# EAGLE design Moof Janibore (EAGLE 9.6.2)
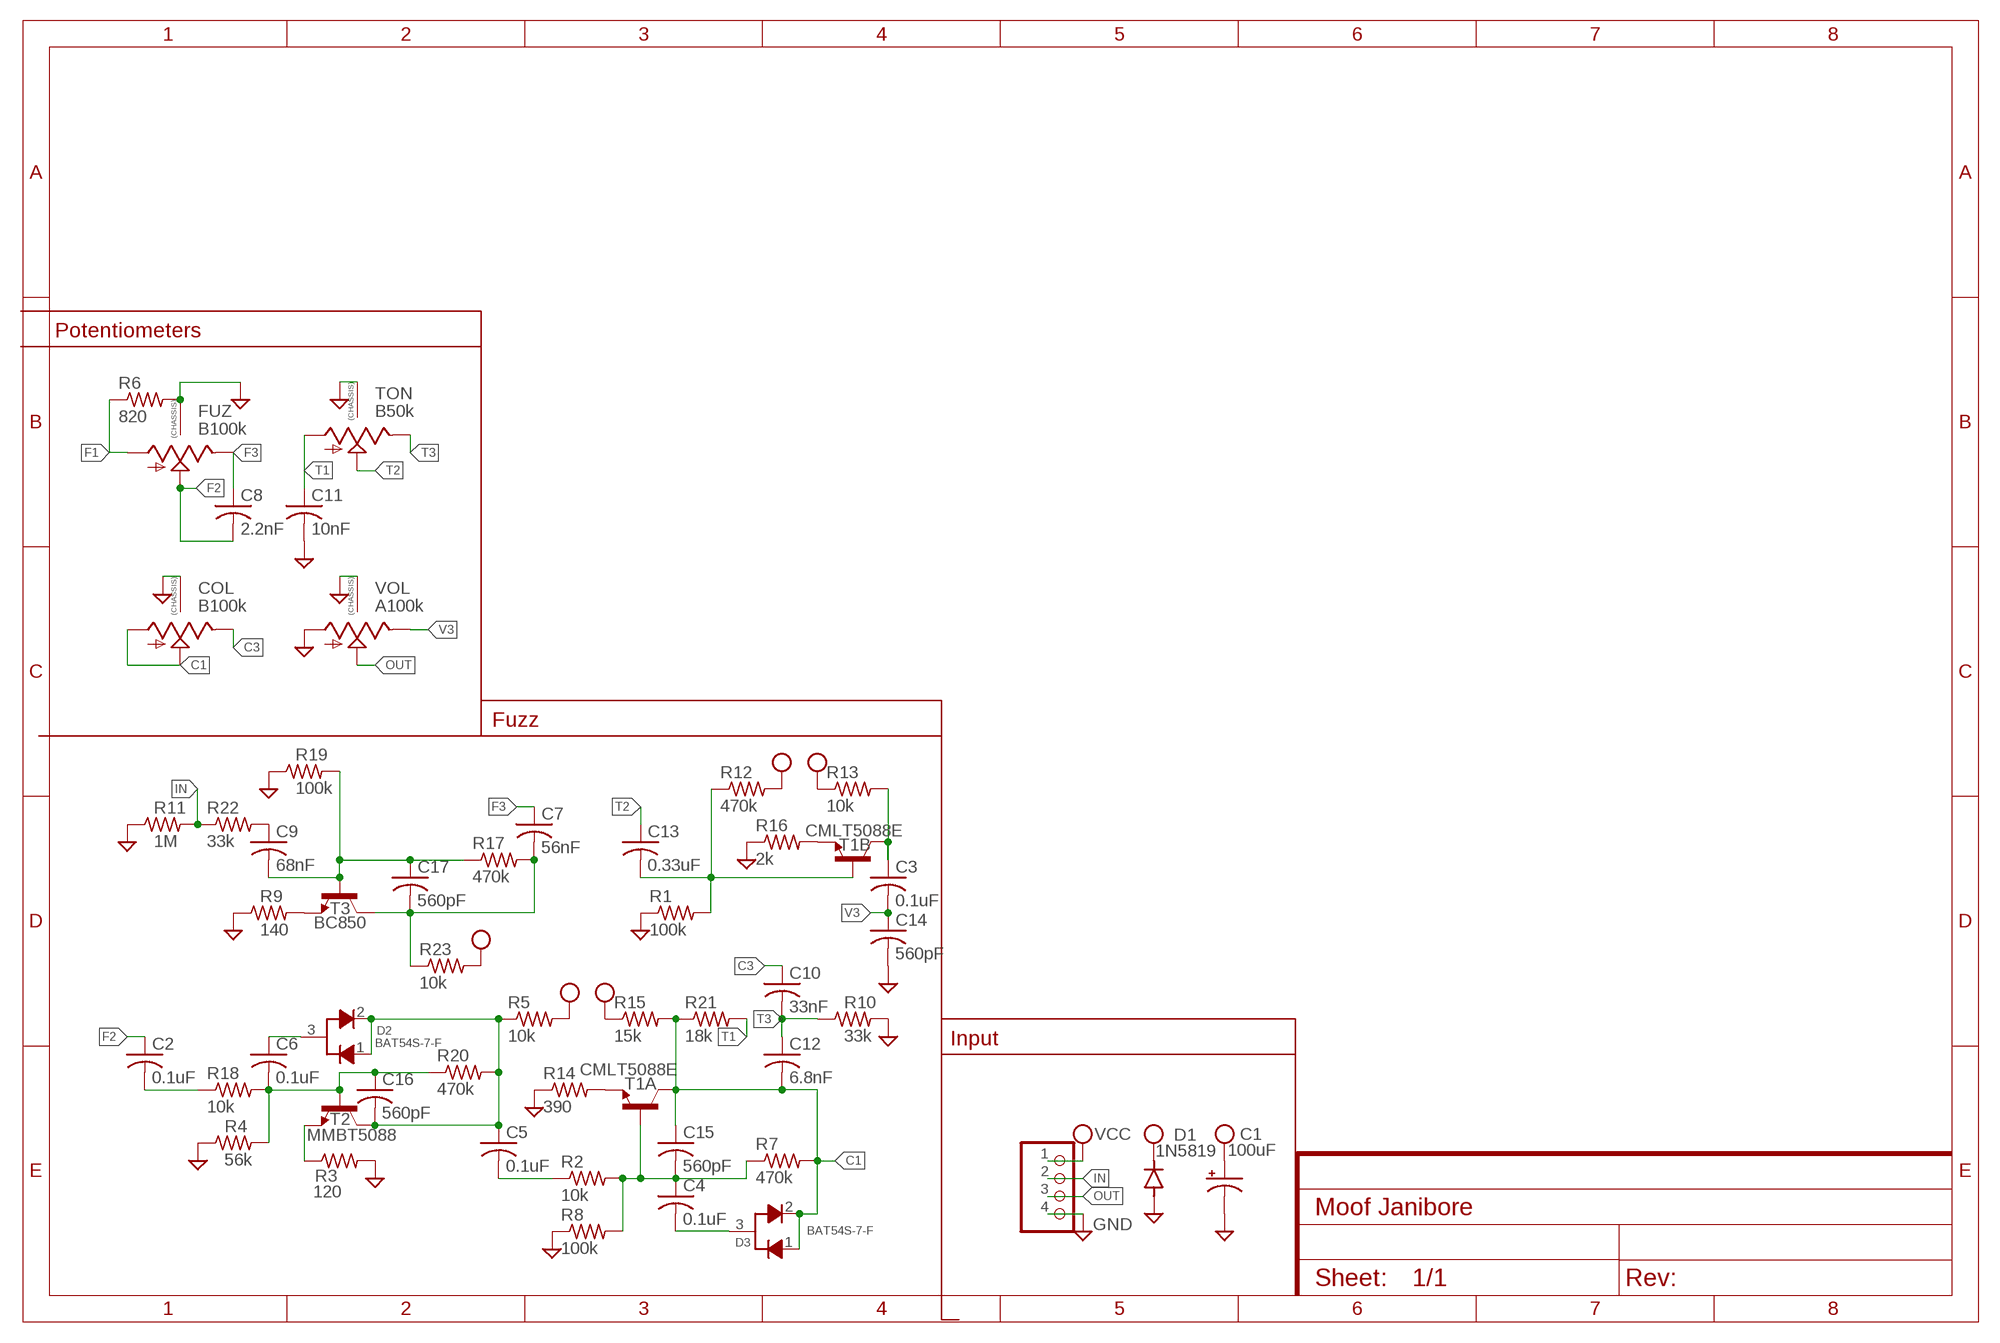
[diagram p0: schematic, sheet 1]

## Parts
C1  100uF  CAP_SMD+THRUPAN_B  [PAN_B_SMD+THRU]
C2  0.1uF  C-USC0402  [C0402]
C3  0.1uF  C-USC0402  [C0402]
C4  0.1uF  C-USC0402  [C0402]
C5  0.1uF  C-USC0402  [C0402]
C6  0.1uF  C-USC0402  [C0402]
C7  56nF  C-USC0402  [C0402]
C8  2.2nF  C-USC0402  [C0402]
C9  68nF  C-USC0402  [C0402]
C10  33nF  C-USC0402  [C0402]
C11  10nF  C-USC0402  [C0402]
C12  6.8nF  C-USC0402  [C0402]
C13  0.33uF  C-USC0402  [C0402]
C14  560pF  C-USC0402  [C0402]
C15  560pF  C-USC0402  [C0402]
C16  560pF  C-USC0402  [C0402]
C17  560pF  C-USC0402  [C0402]
COL  B100k  9MM_SNAP-IN_POT_CHASSIS  [9MM_SNAP-IN_POT]
D1  1N5819  DIODE-SOD123  [SOD123]
D2  BAT54S-7-F  [SOT23-3]
D3  BAT54S-7-F  [SOT23-3]
FUZ  B100k  9MM_SNAP-IN_POT_CHASSIS  [9MM_SNAP-IN_POT]
JP1  PINHD-1X4  [1X04]
R1  100k  R-US_R0402  [R0402]
R2  10k  R-US_R0402  [R0402]
R3  120  R-US_R0402  [R0402]
R4  56k  R-US_R0402  [R0402]
R5  10k  R-US_R0402  [R0402]
R6  820  R-US_R0402  [R0402]
R7  470k  R-US_R0402  [R0402]
R8  100k  R-US_R0402  [R0402]
R9  140  R-US_R0402  [R0402]
R10  33k  R-US_R0402  [R0402]
R11  1M  R-US_R0402  [R0402]
R12  470k  R-US_R0402  [R0402]
R13  10k  R-US_R0402  [R0402]
R14  390  R-US_R0402  [R0402]
R15  15k  R-US_R0402  [R0402]
R16  2k  R-US_R0402  [R0402]
R17  470k  R-US_R0402  [R0402]
R18  10k  R-US_R0402  [R0402]
R19  100k  R-US_R0402  [R0402]
R20  470k  R-US_R0402  [R0402]
R21  18k  R-US_R0402  [R0402]
R22  33k  R-US_R0402  [R0402]
R23  10k  R-US_R0402  [R0402]
T1  CMLT5088E  [SOT563]
T2  MMBT5088  BC850-NPN-SOT23-BEC  [SOT23-BEC]
T3  BC850  BC850-NPN-SOT23-BEC  [SOT23-BEC]
TON  B50k  9MM_SNAP-IN_POT_CHASSIS  [9MM_SNAP-IN_POT]
VOL  A100k  9MM_SNAP-IN_POT_CHASSIS  [9MM_SNAP-IN_POT]

## Nets
C1: C12.2 C15.1 COL.1(A) COL.2(S) D3.1 D3.2 R7.2 R15.2 R21.1 T1.6(A:C)
C3: C10.1 COL.3(E)
F1: FUZ.1(A) R6.1
F2: C2.1 C8.2 FUZ.2(S)
F3: C7.1 C8.1 FUZ.3(E)
GND: C1.- C1.--(-) C11.2 C14.2 COL.CHASSIS1 COL.CHASSIS2 D1.A FUZ.CHASSIS1 FUZ.CHASSIS2 JP1.4 R1.1 R3.2 R4.1 R6.2 R8.1 R9.1 R10.2 R11.1 R14.1 R16.1 R19.1 TON.CHASSIS1 TON.CHASSIS2 VOL.1(A) VOL.CHASSIS1 VOL.CHASSIS2
IN: JP1.2 R11.2 R22.1
N$1: C9.1 R22.2
N$2: C7.2 C17.2 R17.2 R23.1 T3.C
N$3: C9.2 C17.1 R17.1 R19.2 T3.B
N$4: R9.2 T3.E
N$5: C2.2 R18.1
N$6: C6.2 C16.1 R4.2 R18.2 R20.1 T2.B
N$7: R3.1 T2.E
N$8: C5.2 R2.1
N$9: C6.1 D2.3
N$10: C5.1 C16.2 D2.1 D2.2 R5.1 R20.2 T2.C
N$11: C4.1 C15.2 R2.2 R7.1 R8.2 T1.2(A:B)
N$12: R14.2 T1.1(A:E)
N$13: R16.2 T1.4(B:E)
N$14: C13.2 R1.2 R12.1 T1.5(B:B)
N$15: C4.2 D3.3
N$16: C3.1 R13.2 T1.3(B:C)
OUT: JP1.3 VOL.2(S)
T1: C11.1 R21.2 TON.1(A)
T2: C13.1 TON.2(S)
T3: C10.2 C12.1 R10.1 TON.3(E)
V3: C3.2 C14.1 VOL.3(E)
VCC: C1.+ C1.++(+) D1.C JP1.1 R5.2 R12.2 R13.1 R15.1 R23.2

## Notes on the sheet
- Potentiometers
- Fuzz
- Input

## Library data of the parts
C1 = MusicThingModular:CAP_SMD+THRU
C2-C17 = adafruit:C-US: CAPACITOR, American symbol
COL FUZ TON VOL = MusicThingModular:9MM_SNAP-IN_POT_CHASSIS: 9mm vertical snap-in pot, Alpha / Panasonic style, with a connection to the metal chassis for grounding
D1 = diode:DIODE-: DIODE
D2 D3 = Diodes:BAT54S-7-F: DIODE ARRAY SCHOTTKY 30V SOT23-3 Manufacturer's datasheet <https://www.diodes.com/assets/Datasheets/ds11005.pdf>; CREATED_BY: PCBLayout.com; DIGIKEY_PART_NUMBER: BAT54S-FDITR-ND; MANUFACTURER: Diodes Incorporated; MPN: BAT54S-7-F; PACKAGE: SOT-23
JP1 = Connector:PINHD-1X4: PIN HEADER; CATEGORY: CONNECTOR; SUB-CATEGORY: PIN-HEADER
R1-R23 = adafruit:R-US_: RESISTOR, American symbol
T1 = transistor-neu-to92:CMLT5088E: DUAL NPN/NPN L88 TRANSISTORS ENHANCED SPECIFICATION PICOmini(TM) SURFACE MOUNT Source: CMLT5078%20SERIES.pdf
T2 T3 = MusicThingModular:*-NPN-: NPN Transistror BF959 corrected 2008.03.06

## Board
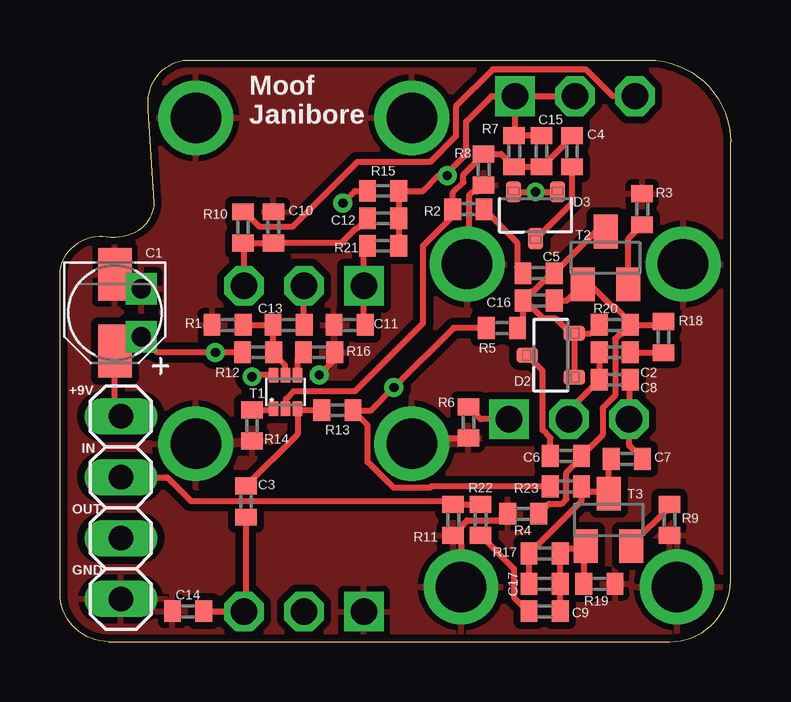
[diagram p1: board, top side]
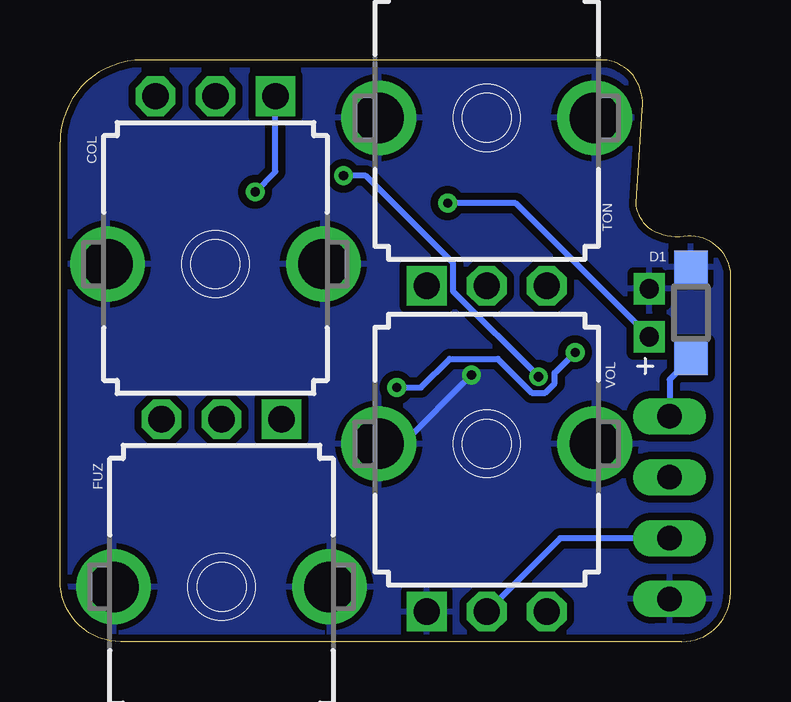
[diagram p2: board, bottom side, seen from below]

Size 27.94 x 24.26 mm. Coordinates in mm from the lower left corner, seen from the top.
Outline: 2.03,0 25.4,0 arc90 27.94,2.54 27.94,20.83 arc90 24.51,24.26 5.29,24.26 arc45 4.06,23.62 arc45 3.68,22.19 3.94,18.32 arc-45 3.43,17.27 arc-45 1.95,16.89 arc90 0,15.45 0,2.03 arc90 2.03,0
Copper layers (1*16): Top 0.035mm / dielectric 1.5mm / Bottom 0.035mm
Design rules "default *": minimum track width 6mil, minimum drill 0.35mm, track to track 6mil, track to pad 6mil, pad to pad 6mil, via to via 6mil, smd to smd 6mil, copper to edge 10mil, drill to drill 6mil, minimum pad ring 10mil, minimum via ring 8mil, stop-mask expansion 4mil, vias tented up to drill 0mil, thermal gap 10mil

### Footprints (pad centres in the part's own frame; a part is rotated, then mirrored left to right if it is on the bottom)
PAN_B_SMD+THRU = smd 2.2 x 1.4: + 1.6,0; - -1.6,0 | drill 0.8 pad 0.9 square: ++ 1,1.1; -- -1,1.1
C0402 = smd 0.7 x 0.9: 1 -0.65,0; 2 0.65,0
9MM_SNAP-IN_POT = drill 1.1 square: 1 -2.5,-7 | drill 1.1 octagon: 2 0,-7; 3 2.5,-7 | drill 2.1 pad 2.794: CHASSIS1 -4.5,0; CHASSIS2 4.5,0
SOD123 = smd 1.4 x 1.4: A 1.9,0; C -1.9,0
SOT23-3 = smd 0.63 x 0.9: 1 -0.915,-0.975; 2 0.915,-0.975; 3 0,0.975
1X04 = drill 1.016 long: 1 -3.81,0; 2 -1.27,0; 3 1.27,0; 4 3.81,0
R0402 = smd 0.7 x 0.9: 1 -0.65,0; 2 0.65,0
SOT563 = smd 0.4 x 0.6: 1 -0.5,-0.7; 2 0,-0.7; 3 0.5,-0.7; 4 0.5,0.7; 5 0,0.7; 6 -0.5,0.7
SOT23-BEC = smd 1 x 1.4: B -0.95,-1.1; C 0,1.1; E 0.95,-1.1

### Placement (x,y rotation side)
C1  2.29,13.72 270 top
C2  23.11,12.06 0 top
C3  7.75,5.84 270 top
C4  21.34,20.45 270 top
C5  19.94,15.37 180 top
C6  21.08,7.75 0 top
C7  23.62,7.62 180 top
C8  23.11,10.92 180 top
C9  20.19,1.27 0 top
C10  7.62,17.27 270 top
C11  12.06,13.21 180 top
C12  13.46,17.65 0 top
C13  9.53,13.21 180 top
C14  5.33,1.27 180 top
C15  20.07,20.45 270 top
C16  19.94,14.22 180 top
C17  20.19,2.41 180 top
COL  21.46,15.75 180 bottom
D1  1.65,13.72 90 bottom
D2  20.45,11.94 90 top
D3  19.81,17.78 180 top
FUZ  21.21,2.29 180 bottom
JP1  2.54,5.59 270 top
R1  6.99,13.21 0 top
R2  17.02,18.03 180 top
R3  24.26,18.03 90 top
R4  19.3,5.33 0 top
R5  18.41,13.08 180 top
R6  17.02,9.14 270 top
R7  18.92,20.45 90 top
R8  17.65,19.68 90 top
R9  25.4,5.08 90 top
R10  8.89,17.27 90 top
R11  16.38,5.08 90 top
R12  8.26,12.06 180 top
R13  11.56,9.65 180 top
R14  8,9.02 90 top
R15  13.46,18.8 0 top
R16  10.79,12.06 180 top
R17  20.19,3.68 180 top
R18  25.15,12.7 90 top
R19  22.48,2.41 180 top
R20  23.11,13.21 180 top
R21  13.46,16.51 180 top
R22  17.53,5.08 270 top
R23  21.08,6.48 180 top
T1  9.4,10.41 0 top
T2  22.73,16 0 top
T3  22.86,5.08 0 top
TON  10.16,21.84 0 bottom
VOL  10.16,8.26 0 bottom

### Tracks (layer width: path | path; a pad name or v marks a point on that pad's centre or on a via)
C1  (via drill 0.38)
  Top 0.254: R21.1 C12.2 R15.2 15.13,18.8 15.76,19.43 v16.13,19.43 16.13,19.54 16.92,20.34 16.92,21.69 17.98,22.75 COL.1 18.96,22.73 | D3.1 v19.81,18.75 D3.2 | C15.1 R7.2 18.96,21.14 18.96,22.73 | T1.6 8.07,11.11 v8,11.05 | COL.2 21.45,22.73 18.96,22.73
  Bottom 0.254: v19.81,18.75 18.96,19.6 COL.1 | v8,11.05 11.56,14.6 11.56,15.79 15.2,19.43 v16.13,19.43
C3
  Top 0.254: COL.3 23.02,22.75 21.92,23.85 18.02,23.85 16.5,22.33 16.5,21.08 15.42,20.01 12.39,20.01 9.67,17.29 8.32,17.29 7.7,17.92 C10.1
F1
  Top 0.254: FUZ.1 17.53,9.29 R6.1
F2
  Top 0.254: FUZ.2 21.21,9.67 C8.2 C2.1
F3
  Top 0.254: C8.1 23.71,10.87 FUZ.3 23.71,8.18 C7.1
GND  (via drill 0.38)
  Top 0.254: C1.-- 2.89,14.72 C1.- | R16.1 11.45,11.77 v10.79,11.12 | R8.1 17.38,18.76 17.2,18.76 17.04,18.6 17.04,15.82 COL.CHASSIS1 | FUZ.CHASSIS1 16.71,4.1 R11.1 16.8,4.84 16.8,4.9 16.96,5.06 18.38,5.06 R4.1 | VOL.CHASSIS1 14.9,8.49 R6.2
  Bottom 0.254: v10.79,11.12 13.66,8.26 VOL.CHASSIS1
  pour Top (isolate 0.305): 0,0 29.21,0 29.21,24.13 27.94,25.4 0,25.4
  pour Bottom (isolate 0.305): 0,0 29.21,0 29.21,24.13 27.94,25.4 0,25.4
IN
  Top 0.254: JP1.2 4.46,6.86 5.45,5.86 16.25,5.86 R11.2 R22.1
N$1
  Top 0.254: R22.2 18.91,3.04 18.91,1.85 19.49,1.27 C9.1
N$2
  Top 0.254: C17.2 R17.2 21.73,5.87 R23.1 21.94,6.26 22.95,6.26 T3.C 22.86,7.51 C7.2
N$3
  Top 0.254: T3.B 21.83,3.9 | 21.83,3.9 R19.2 | 21.83,3.9 21.06,3.9 R17.1 C17.1 C9.2
N$4
  Top 0.254: T3.E 23.81,4.04 25.4,5.62 R9.2
N$5
  Top 0.254: C2.2 25.13,12.06 R18.1
N$6
  Top 0.254: 23.88,13.21 R20.1 23.35,12.79 23.3,12.79 23.14,12.63 23.14,10.27 22.61,9.74 22.61,8.62 C6.2 21.73,7.67 21.1,7.04 21.1,5.95 20.9,5.75 20.37,5.75 R4.2 | 23.88,13.21 25,13.21 R18.2 | 23.88,13.21 23.16,13.92 23.07,13.92 22.09,14.9 T2.B 21.11,14.22 C16.1
N$7
  Top 0.254: T2.E 23.68,16.81 R3.1
N$8
  Top 0.254: R2.1 19.05,16.65 19.05,15.61 C5.2
N$9
  Top 0.254: C6.1 20.43,8.5 20.11,8.83 20.11,11.3 D2.3
N$10
  Top 0.254: R20.2 22.11,12.85 D2.2 21.42,12.7 | 21.42,12.7 D2.1 | C16.2 19.7,14.64 19.75,14.64 20.48,15.37 C5.1 22.32,17.1 T2.C | 21.42,12.7 20.63,13.49 20.12,13.49 19.39,14.22 C16.2 | C16.2 19.29,13.3 R5.1
N$11
  Top 0.254: C4.1 21.34,21.07 C15.2 R7.1 18.39,20.34 R8.2 16.8,19.48 16.8,19.15 16.37,18.72 R2.2 16.37,17.75 15.13,16.51 15.13,13.28 12.29,10.45 9.73,10.45 9.42,10.13 9.42,9.73 T1.2
N$12
  Top 0.254: R14.2 8.85,9.67 T1.1
N$13
  Top 0.254: T1.4 9.9,11.82 R16.2
N$14
  Top 0.254: T1.5 9.38,11.13 9.38,11.53 8.9,12 R12.1 8.88,12.1 C13.2 R1.2
N$15
  Top 0.254: C4.2 21.32,19.78 21.32,18.28 19.84,16.8 D3.3
N$16
  Top 0.254: R13.2 9.96,9.65 T1.3 9.9,8.64 C3.1
OUT
  Bottom 0.254: JP1.3 7.1,4.32 VOL.2
T1
  Top 0.254: C11.1 12.66,13.26 TON.1 12.66,16.36 R21.2
T2
  Top 0.254: C13.1 10.16,13.22 TON.2
T3
  Top 0.254: TON.3 7.66,16.58 C10.2 R10.1 11.73,16.62 12.35,17.24 12.4,17.24 C12.1
V3
  Top 0.254: C14.1 7.64,1.27 VOL.3 7.75,1.34 C3.2
VCC  (via drill 0.38)
  Top 0.254: JP1.1 2.29,9.65 C1.+ 2.89,12.72 C1.++ 4.04,12.06 v6.48,12.06 R12.2 | R5.2 16.4,13.08 v13.91,10.6 12.97,9.65 R13.1 12.82,9.04 12.82,7.49 13.9,6.42 15.42,6.42 15.48,6.48 R23.2 | v11.79,18.29 12.3,18.8 R15.1
  Bottom 0.254: D1.C 2.54,10.93 JP1.1 | C1.++ 8.96,18.29 v11.79,18.29 | v6.48,12.06 7.33,11.21 7.33,10.77 7.72,10.38 8.28,10.38 9.7,11.79 11.71,11.79 12.9,10.6 v13.91,10.6

### Text on the board
tPlace: Moof / Janibore | +9V | IN | OUT | GND